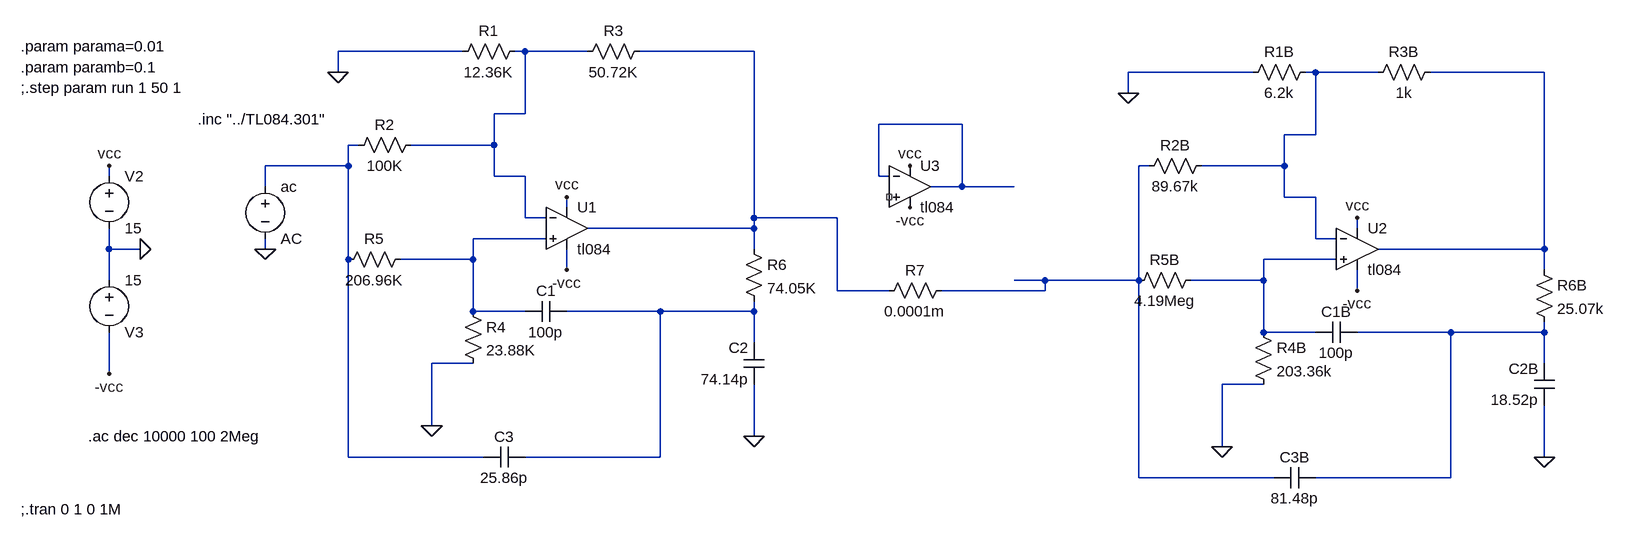
[diagram p0: schematic Celda Sedra con pote sin montecarlo.asc]
Celda Sedra con pote sin montecarlo.asc, the LTspice schematic file:
Version 4
SHEET 1 2128 680
WIRE 368 -160 176 -160
WIRE 464 -160 448 -160
WIRE 560 -160 464 -160
WIRE 816 -160 640 -160
WIRE 176 -128 176 -160
WIRE 1584 -128 1392 -128
WIRE 1680 -128 1664 -128
WIRE 1776 -128 1680 -128
WIRE 2032 -128 1856 -128
WIRE 1392 -96 1392 -128
WIRE 464 -64 464 -160
WIRE 464 -64 416 -64
WIRE 1136 -48 1008 -48
WIRE 1680 -32 1680 -128
WIRE 1680 -32 1632 -32
WIRE 208 -16 192 -16
WIRE 416 -16 416 -64
WIRE 416 -16 288 -16
WIRE 192 16 192 -16
WIRE 192 16 64 16
WIRE 1424 16 1408 16
WIRE 1632 16 1632 -32
WIRE 1632 16 1504 16
WIRE -176 32 -176 16
WIRE 416 32 416 -16
WIRE 464 32 416 32
WIRE 1008 32 1008 -48
WIRE 1024 32 1008 32
WIRE 64 48 64 16
WIRE 1136 48 1136 -48
WIRE 1136 48 1088 48
WIRE 1216 48 1136 48
WIRE 1632 64 1632 16
WIRE 1680 64 1632 64
WIRE 528 80 528 64
WIRE 464 96 464 32
WIRE 496 96 464 96
WIRE 816 96 816 -160
WIRE 944 96 816 96
WIRE 816 112 816 96
WIRE 816 112 560 112
WIRE 1744 112 1744 96
WIRE 496 128 384 128
WIRE 1680 128 1680 64
WIRE 1712 128 1680 128
WIRE -176 144 -176 112
WIRE -128 144 -176 144
WIRE 64 144 64 128
WIRE 816 144 816 112
WIRE 2032 144 2032 -128
WIRE 2032 144 1776 144
WIRE 192 160 192 16
WIRE 384 160 384 128
WIRE 384 160 272 160
WIRE 1712 160 1600 160
WIRE 528 176 528 144
WIRE 2032 176 2032 144
WIRE -176 192 -176 144
WIRE 1264 192 1216 192
WIRE 1408 192 1408 16
WIRE 1408 192 1264 192
WIRE 1600 192 1600 160
WIRE 1600 192 1488 192
WIRE 944 208 944 96
WIRE 1024 208 944 208
WIRE 1264 208 1264 192
WIRE 1264 208 1104 208
WIRE 1744 208 1744 176
WIRE 384 240 384 160
WIRE 464 240 384 240
WIRE 672 240 528 240
WIRE 816 240 816 224
WIRE 816 240 672 240
WIRE 1600 272 1600 192
WIRE 1680 272 1600 272
WIRE 1888 272 1744 272
WIRE 2032 272 2032 256
WIRE 2032 272 1888 272
WIRE 816 288 816 240
WIRE 384 320 320 320
WIRE 2032 320 2032 272
WIRE -176 336 -176 272
WIRE 1600 352 1536 352
WIRE 320 416 320 320
WIRE 816 432 816 352
WIRE 1536 448 1536 352
WIRE 192 464 192 160
WIRE 400 464 192 464
WIRE 672 464 672 240
WIRE 672 464 464 464
WIRE 2032 464 2032 384
WIRE 1408 496 1408 192
WIRE 1616 496 1408 496
WIRE 1888 496 1888 272
WIRE 1888 496 1680 496
FLAG -128 144 0
FLAG -176 16 vcc
FLAG -176 336 -vcc
FLAG 528 64 vcc
FLAG 528 176 -vcc
FLAG 176 -128 0
FLAG 816 432 0
FLAG 64 144 0
FLAG 320 416 0
FLAG 1744 96 vcc
FLAG 1744 208 -vcc
FLAG 1392 -96 0
FLAG 2032 464 0
FLAG 1536 448 0
FLAG 1056 16 vcc
FLAG 1056 80 -vcc
SYMBOL Opamps\\opamp2 528 48 R0
SYMATTR InstName U1
SYMATTR Value tl084
SYMBOL voltage -176 16 R0
WINDOW 123 0 0 Left 0
WINDOW 39 0 0 Left 0
SYMATTR InstName V2
SYMATTR Value 15
SYMBOL voltage -176 176 R0
WINDOW 0 24 96 Left 2
WINDOW 3 24 16 Left 2
WINDOW 123 0 0 Left 0
WINDOW 39 0 0 Left 0
SYMATTR InstName V3
SYMATTR Value 15
SYMBOL res 304 -32 R90
WINDOW 0 0 56 VBottom 2
WINDOW 3 32 56 VTop 2
SYMATTR InstName R2
SYMATTR Value 100K
SYMBOL res 656 -176 R90
WINDOW 0 0 56 VBottom 2
WINDOW 3 32 56 VTop 2
SYMATTR InstName R3
SYMATTR Value 50.72K
SYMBOL res 464 -176 R90
WINDOW 0 0 56 VBottom 2
WINDOW 3 32 56 VTop 2
SYMATTR InstName R1
SYMATTR Value 12.36K
SYMBOL res 800 128 R0
SYMATTR InstName R6
SYMATTR Value 74.05K
SYMBOL res 368 224 R0
SYMATTR InstName R4
SYMATTR Value 23.88K
SYMBOL cap 832 352 R180
WINDOW 0 24 56 Left 2
WINDOW 3 24 8 Left 2
SYMATTR InstName C2
SYMATTR Value 74.14p
SYMBOL cap 400 480 R270
WINDOW 0 32 32 VTop 2
WINDOW 3 0 32 VBottom 2
SYMATTR InstName C3
SYMATTR Value 25.86p
SYMBOL voltage 64 32 R0
WINDOW 123 0 0 Left 0
WINDOW 39 0 0 Left 0
SYMATTR InstName ac
SYMATTR Value AC
SYMBOL res 288 144 R90
WINDOW 0 0 56 VBottom 2
WINDOW 3 32 56 VTop 2
SYMATTR InstName R5
SYMATTR Value 206.96K
SYMBOL cap 528 224 R90
WINDOW 0 0 32 VBottom 2
WINDOW 3 32 32 VTop 2
SYMATTR InstName C1
SYMATTR Value 100p
SYMBOL Opamps\\opamp2 1744 80 R0
SYMATTR InstName U2
SYMATTR Value tl084
SYMBOL res 1520 0 R90
WINDOW 0 0 56 VBottom 2
WINDOW 3 32 56 VTop 2
SYMATTR InstName R2B
SYMATTR Value 89.67k
SYMBOL res 1872 -144 R90
WINDOW 0 0 56 VBottom 2
WINDOW 3 32 56 VTop 2
SYMATTR InstName R3B
SYMATTR Value 1k
SYMBOL res 1680 -144 R90
WINDOW 0 0 56 VBottom 2
WINDOW 3 32 56 VTop 2
SYMATTR InstName R1B
SYMATTR Value 6.2k
SYMBOL res 2016 160 R0
SYMATTR InstName R6B
SYMATTR Value 25.07k
SYMBOL res 1584 256 R0
SYMATTR InstName R4B
SYMATTR Value 203.36k
SYMBOL cap 2048 384 R180
WINDOW 0 24 56 Left 2
WINDOW 3 24 8 Left 2
SYMATTR InstName C2B
SYMATTR Value 18.52p
SYMBOL cap 1616 512 R270
WINDOW 0 32 32 VTop 2
WINDOW 3 0 32 VBottom 2
SYMATTR InstName C3B
SYMATTR Value 81.48p
SYMBOL res 1504 176 R90
WINDOW 0 0 56 VBottom 2
WINDOW 3 32 56 VTop 2
SYMATTR InstName R5B
SYMATTR Value 4.19Meg
SYMBOL cap 1744 256 R90
WINDOW 0 0 32 VBottom 2
WINDOW 3 32 32 VTop 2
SYMATTR InstName C1B
SYMATTR Value 100p
SYMBOL Opamps\\opamp2 1056 -16 R0
SYMATTR InstName U3
SYMATTR Value tl084
SYMBOL res 1120 192 R90
WINDOW 0 0 56 VBottom 2
WINDOW 3 32 56 VTop 2
SYMATTR InstName R7
SYMATTR Value 0.0001m
TEXT -208 432 Left 2 !.ac dec 10000 100 2Meg
TEXT -312 -168 Left 2 !.param parama=0.01
TEXT -312 -136 Left 2 !.param paramb=0.1
TEXT -312 -104 Left 2 !;.step param run 1 50 1
TEXT -40 -56 Left 2 !.inc "../TL084.301"
TEXT -312 544 Left 2 !;.tran 0 1 0 1M

The netlist it stands for:
* Celda Sedra con pote sin montecarlo.asc
XU1 N008 N001 vcc -vcc N002 tl084  ; pins In+ In- V+ V- OUT
V2 vcc 0 15
V3 0 -vcc 15
R2 N001 N006 100K
R3 N002 N001 50.72K
R1 N001 0 12.36K
R6 N002 N010 74.05K
R4 N008 0 23.88K
C2 0 N010 74.14p
C3 N006 N010 25.86p
V§ac N006 0 AC
R5 N008 N006 206.96K
C1 N010 N008 100p
XU2 N009 N003 vcc -vcc N004 tl084  ; pins In+ In- V+ V- OUT
R2B N003 N007 89.67k
R3B N004 N003 1k
R1B N003 0 6.2k
R6B N004 N011 25.07k
R4B N009 0 203.36k
C2B 0 N011 18.52p
C3B N007 N011 81.48p
R5B N009 N007 4.19Meg
C1B N011 N009 100p
XU3 NC_01 N005 vcc -vcc N005 tl084  ; pins In+ In- V+ V- OUT
R7 N007 N002 0.0001m
.ac dec 10000 100 2Meg
.param parama=0.01
.param paramb=0.1
;.step param run 1 50 1
.inc "../TL084.301"
;.tran 0 1 0 1M
.backanno
.end